# Altium project Driver Morpheus CENTRAL.PrjPcb
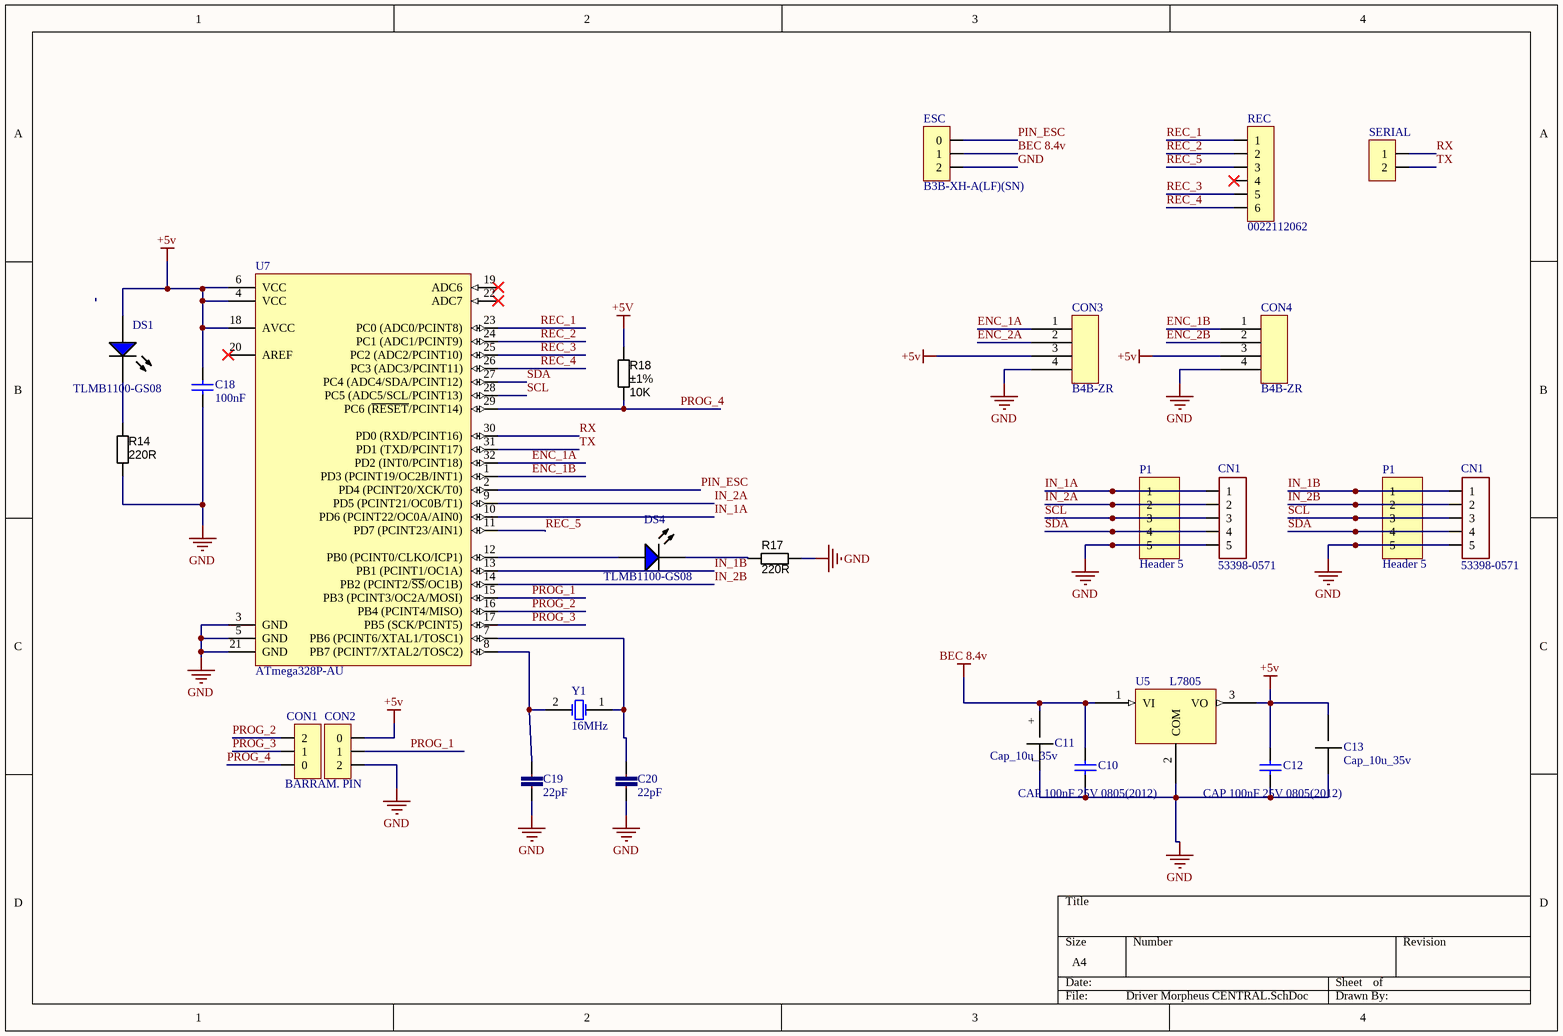
[diagram p0: Driver Morpheus CENTRAL.SchDoc]
1 sheet, 26 parts. Net scope: global (net labels, ports and power ports of the same name join across sheets).
Board file: Driver Morpheus CENTRAL.PcbDoc

## Sheet Driver Morpheus CENTRAL.SchDoc
size A4

### Parts
(Parts that share a designator on the sheet are numbered #1, #2 ... from top to bottom, then left to right.)
C10  CAP 100nF 25V 0805(2012)  [CAPC0805(2012)145_M]
C11  Cap_10u_35v  [CAP POL 2917/7343]
C12  CAP 100nF 25V 0805(2012)  [CAPC0805(2012)145_M]
C13  Cap_10u_35v  [CAP POL 2917/7343]
C18  value 100nF  [CAP-0402]  (hidden comment: GRM155R71C104KA88D)
C19  22pF  [0402-CAP]
C20  22pF  [0402-CAP]
CN1#1  53398-0571  [53398-05]
CN1#2  53398-0571  [53398-05]
CON1  BARRAM. PIN  [1x3POS_HEADER]
CON2  (no value)  [1x3POS_HEADER]
CON3  B4B-ZR  [B4B-ZR]
CON4  B4B-ZR  [B4B-ZR]
DS1  TLMB1100-GS08  [VISH-TLMX1100-2_V]
DS4  TLMB1100-GS08  [VISH-TLMX1100-2_V]
ESC  B3B-XH-A(LF)(SN)  [03x01_Conector_Male_Shroudred]
P1#1  Header 5  [HDR1X5]
P1#2  Header 5  [HDR1X5]
R14  value 220R  [RESC1608X55N]  (hidden comment: Thick Film)
R17  value 220R  [RESC1608X55N]  (hidden comment: Thick Film)
R18  value 10K  Tolerance: ±1%  [RESC1608X55N]  (hidden comment: Thick Film)
REC  0022112062  [06x01_Conector_Male]
SERIAL  0022112022  [02x01_Conector_Male]  (value not drawn)
U5  L7805  [D2PAK-3]
U7  ATmega328P-AU  [32A_N]
Y1  16MHz  [CRYSTAL_HC49-US-SM]

### Nets
+5V: C12.2 C13.2 C18.1 CON2.0 CON3.3 CON4.3 DS1.1(A) R18.1 U5.3(VO) U7.4(VCC) U7.6(VCC) U7.18(AVCC)
BEC 8.4v: C10.2 C11.+ ESC.1 U5.1(VI)
GND: C10.1 C11.- C12.1 C13.1 C18.2 C19.2 C20.2 CN1#1.5 CN1#2.5 CON2.2 CON3.4 CON4.4 ESC.2 P1#1.5 P1#2.5 R14.2 R17.2 U5.2(COM) U7.3(GND) U7.5(GND) U7.21(GND)
ENC_1A: CON3.1 U7.32(PD2_(INT0/PCINT18))
ENC_1B: CON4.1 U7.1(PD3_(PCINT19/OC2B/INT1))
ENC_2A: CON3.2
ENC_2B: CON4.2
IN_1A: CN1#1.1 P1#1.1 U7.10(PD6_(PCINT22/OC0A/AIN0))
IN_1B: CN1#2.1 P1#2.1 U7.13(PB1_(PCINT1/OC1A))
IN_2A: CN1#1.2 P1#1.2 U7.9(PD5_(PCINT21/OC0B/T1))
IN_2B: CN1#2.2 P1#2.2 U7.14(PB2_(PCINT2/~{SS}/OC1B))
PIN_ESC: ESC.0 U7.2(PD4_(PCINT20/XCK/T0))
PROG_1: CON2.1 U7.15(PB3_(PCINT3/OC2A/MOSI))
PROG_2: CON1.2 U7.16(PB4_(PCINT4/MISO))
PROG_3: CON1.1 U7.17(PB5_(SCK/PCINT5))
PROG_4: CON1.0 R18.2 U7.29(PC6_(~{RESET}/PCINT14))
REC_1: REC.1 U7.23(PC0_(ADC0/PCINT8))
REC_2: REC.2 U7.24(PC1_(ADC1/PCINT9))
REC_3: REC.5 U7.25(PC2_(ADC2/PCINT10))
REC_4: REC.6 U7.26(PC3_(ADC3/PCINT11))
REC_5: REC.3 U7.11(PD7_(PCINT23/AIN1))
RX: SERIAL.1 U7.30(PD0_(RXD/PCINT16))
SCL: CN1#1.3 CN1#2.3 P1#1.3 P1#2.3 U7.28(PC5_(ADC5/SCL/PCINT13))
SDA: CN1#1.4 CN1#2.4 P1#1.4 P1#2.4 U7.27(PC4_(ADC4/SDA/PCINT12))
TX: SERIAL.2 U7.31(PD1_(TXD/PCINT17))
NetC19_1: C19.1 U7.8(PB7_(PCINT7/XTAL2/TOSC2)) Y1.2(OSC2)
NetC20_1: C20.1 U7.7(PB6_(PCINT6/XTAL1/TOSC1)) Y1.1(OSC1)
NetDS1_2: DS1.2(K) R14.1
NetDS4_1: DS4.1(A) U7.12(PB0_(PCINT0/CLKO/ICP1))
NetDS4_2: DS4.2(K) R17.1

Not connected (* = marked no-connect by the designer): REC 4*; U7 19(ADC6)* 20(AREF)* 22(ADC7)*

### Library data of the parts
C10 C12 = CMP-1036-04408-1: CAP 100nF 25V ±5% 0805 (2012 Metric) Thickness 1.45mm SMD; Case-Metric: 2012; Case-EIA: 0805; Tolerance: Â±5%; Value: 100nF; Rated Voltage: 25 V; Max Thickness: 1.45 mm; Technology: SMT
C18 = Cap 100nF 0402: 0.10µF 16V Ceramic Capacitor X7R 0402 (1005 Metric) 0.039" L x 0.020" W (1.00mm x 0.50mm)
C19 C20 = CC0402-22P-5: CAP CER 22PF 50V 1% NP0 0402; Part No: GRM1555C1H220FA01D; Cod EMS: 05.281.019.517; Value: 22p
CN1#1 CN1#2 = 53398-0571-5: CONN HEADER 5POS 1.25MM VERT SM; Cod EMS: 05.285.005.201; Part No: 53398-0571
CON1 CON2 ESC = 03x01_Conector_Male_Shroudred: CONN HEADER XH TOP 3POS 2.5MM
DS1 = CMP-1666-00028-1: Red LED, 10 mA, 3.9 V, -40 to 100 degC, 2-Pin SMD (0603), RoHS, Tape and Reel; Tolerance: 10%; Voltage Rating: 100 V; Capacitance: 10 nF; Type (Capacitors): X7R; Case\Package: Radial; ComponentLink1Description: Manufacturer URL; REACH SVHC: No SVHC; Package Quantity: 500; PackageDescription: 2-Pin Surface Mount Device, Body 1.6 x 0.8 mm; Pins: 2; ComponentLink2URL: http://download.siliconexpert.com/pdfs/2016/8/7/12/43/26/667/vsh_/manual/379263299541529tlmb1100.pdf; RoHSCompliant: true; Lead Pitch: 2.54 mm; Height: 2.54 mm; DatasheetVersion: Rev. 2.7, 03/2016; Length: 5.33 mm; ComponentLink1URL: http://www.vishay.com/; Min Operating Temperature: -55 degC; PackageReference: 0603; Packaging: Bulk; ComponentLink2Description: Datasheet; Max Operating Temperature: 125 degC; Radiation Hardening: No; Width: 3.81 mm; Mount: Through Hole
DS4 = CMP-1666-00028-1: Green LED, 10 mA, 3.9 V, -40 to 100 degC, 2-Pin SMD (0603), RoHS, Tape and Reel; Tolerance: 10%; Voltage Rating: 100 V; Capacitance: 10 nF; Type (Capacitors): X7R; Case\Package: Radial; ComponentLink1Description: Manufacturer URL; REACH SVHC: No SVHC; Package Quantity: 500; PackageDescription: 2-Pin Surface Mount Device, Body 1.6 x 0.8 mm; Pins: 2; ComponentLink2URL: http://download.siliconexpert.com/pdfs/2016/8/7/12/43/26/667/vsh_/manual/379263299541529tlmb1100.pdf; RoHSCompliant: true; Lead Pitch: 2.54 mm; Height: 2.54 mm; DatasheetVersion: Rev. 2.7, 03/2016; Length: 5.33 mm; ComponentLink1URL: http://www.vishay.com/; Min Operating Temperature: -55 degC; PackageReference: 0603; Packaging: Bulk; ComponentLink2Description: Datasheet; Max Operating Temperature: 125 degC; Radiation Hardening: No; Width: 3.81 mm; Mount: Through Hole
P1#1 P1#2 = Header 5: Header, 5-Pin; LatestRevisionDate: 17-Jul-2002; LatestRevisionNote: Re-released for DXP Platform.; Publisher: Altium Limited
R14 R17 = RES_220R_0603_5%: Resistor SMD chip 220 Ohm 0.1W 5% 0603; Manufacturer 1: Yageo; Manufacturer Part Number 1: RC0603JR-07220RL; Ratings: 1/10 W; SCDType: spec; Manufacturer 5: Royal Ohm; Manufacturer Part Number 5: 0603WAJ0221; Package / Case: 0603 (1608 metric); Tolerance: ±5%; Material: Thick Film; Supplier 1: Digi-Key; Supplier Part Number 1: 311-220GRCT-ND; Supplier 2: Digi-Key; Supplier Part Number 2: P220GCT-ND; Manufacturer 2: Panasonic Electronic Components; Manufacturer Part Number 2: ERJ-3GEYJ221V; RoHS 2: RoHS Compliant; ComponentLink2URL: http://industrial.panasonic.com/www-cgi/jvcr13pz.cgi?E+PZ+3+AOA0001+ERJ3GEYJ221V+7+WW; ComponentLink2Description: http://industrial.panasonic.com/www-cgi/jvcr13pz.cgi?E+PZ+3+AOA0001+ERJ3GEYJ221V+7+WW; ComponentLink1URL: http://www.yageo.com/documents/recent/PYu-RC0603_51_RoHS_L_4.pdf; ComponentLink1Description: http://www.yageo.com/documents/recent/PYu-RC0603_51_RoHS_L_4.pdf; Supplier 3: Digi-Key; Supplier Part Number 3: RMCF0603JT220RCT-ND; Manufacturer 3: Stackpole Electronics Inc; Manufacturer Part Number 3: RMCF0603JT220R; RoHS 3: RoHS Compliant; ComponentLink3URL: http://www.seielect.com/Catalog/SEI-RMCF_RMCP.pdf; ComponentLink3Description: http://www.seielect.com/Catalog/SEI-RMCF_RMCP.pdf; Supplier 4: Digi-Key; Supplier Part Number 4: RHM220CGCT-ND; Manufacturer 4: Rohm Semiconductor; Manufacturer Part Number 4: MCR03ERTJ221; RoHS 4: RoHS Compliant; ComponentLink4URL: http://rohmfs.rohm.com/en/products/databook/datasheet/passive/resistor/chip_resistor/mcr_g.pdf; ComponentLink4Description: http://rohmfs.rohm.com/en/products/databook/datasheet/passive/resistor/chip_resistor/mcr_g.pdf; RoHS 1: RoHS Compliant
R18 = RES_10K_0603_1%: Resistor SMD chip 10k Ohm 0.1W 1% 0603; Manufacturer 1: Yageo; Manufacturer Part Number 1: RC0603FR-0710KL; Ratings: 1/10W; SCDType: spec; Package / Case: 0603 (1608 Metric); Supplier 1: Digi-Key; Supplier Part Number 1: 311-10.0KHRCT-ND
REC = 06x01_Conector_Male: CONN HEADER 6POS .100 VERT GOLD
SERIAL = 02x01_Conector_Male: CONN HEADER 2POS .100 VERT GOLD
U5 = LM7805
U7 = ATmega328P-AU: 8-bit AVR Microcontroller, 32KB Flash, 1KB EEPROM, 2KB SRAM, 32-pin TQFP, Industrial Grade (-40°C to 85°C); DatasheetVersion: revD, May-2011; PackageVersion: revC, Oct-2010; PackageReference: 32A; PackageDescription: 32-Lead, 7x7x1.0 mm Body, 0.8mm Lead Pitch, Thin Profile Plastic Quad Flat Package (TQFP); Code_JEDEC: MS-026-ABA; ComponentLink1Description: Manufacturer URL; ComponentLink1URL: http://www.atmel.com/; ComponentLink2Description: ATmega48A/48PA/88A/88PA/168A/168PA/328/328P Datasheet; ComponentLink2URL: http://www.atmel.com/dyn/resources/prod_documents/doc8271.pdf; ComponentLink3Description: ATmega48A/48PA/88A/88PA/168A/168PA/328/328P Summary; ComponentLink3URL: http://www.atmel.com/dyn/resources/prod_documents/8271S.pdf
Y1 = XTAL: Crystal Oscillator; Published: 8-Jun-2000; LatestRevisionDate: 17-Jul-2002; LatestRevisionNote: Re-released for DXP Platform.; PackageReference: R38; Publisher: Altium Limited; PackageDescription: Crystal, Thru-Hole; 2 Leads; Body 3.1 x 8.2 mm (Dia.xH)